# Altium schematic sheet Power.SchDoc: Power
size A; Engineer: Benjamin Beaudoin; Revision: v0.1
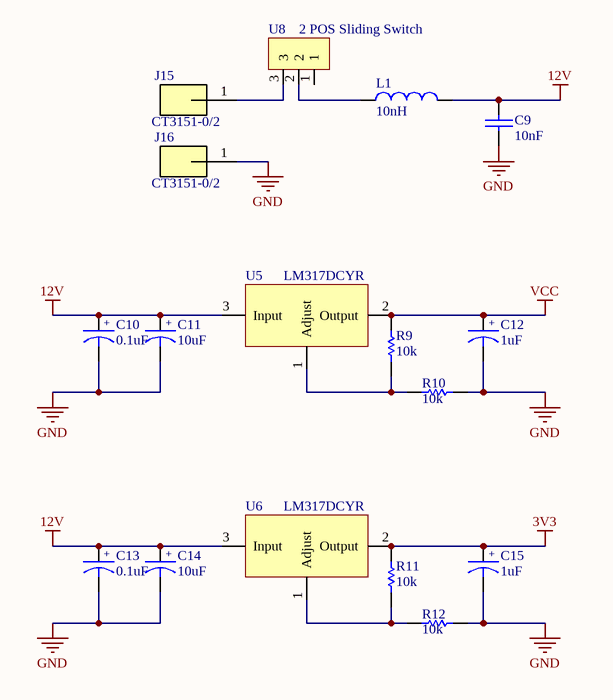
[diagram p0: Power.SchDoc]

## Parts
C9  10nF  [0603C]
C10  0.1uF  [0603C]
C11  10uF  [0603C]
C12  1uF  [0603C]
C13  0.1uF  [0603C]
C14  10uF  [0603C]
C15  1uF  [0603C]
J15  CT3151-0/2  [CT3151-0/2]
J16  CT3151-0/2  [CT3151-0/2]
L1  10nH  [0603C]
R9  10k  [0603C]
R10  10k  [0603C]
R11  10k  [0603C]
R12  10k  [0603C]
U5  LM317DCYR  [LM317]
U6  LM317DCYR  [LM317]
U8  2 POS Sliding Switch  [2 POS Sliding switch]

## Nets
3V3: C15.1 R11.2 U6.2(Output)
12V: C9.1 C10.1 C11.1 C13.1 C14.1 L1.2 U5.3(Input) U6.3(Input)
GND: C9.2 C10.2 C11.2 C12.2 C13.2 C14.2 C15.2 J16.1 R10.2 R12.2
VCC: C12.1 R9.2 U5.2(Output)
NetJ15_1: J15.1 U8.3
NetL1_1: L1.1 U8.2
NetR9_1: R9.1 R10.1 U5.1(Adjust)
NetR11_1: R11.1 R12.1 U6.1(Adjust)

Not connected (* = marked no-connect by the designer): U8 1

## Notes on the sheet
- (in symbol CPoly) +

## Library data of the parts
C9 = C: Capacitor; Power_WV_SRF: 25V; MFGPN: *; MFG: *; Value: 10nF; Tolerance: *; TempCo: *; Distributor: *; CMPN: *
C10-C15 = CPoly: Cap Poly; Power_WV_SRF: 35V; MFG: *; MFGPN: *; Tolerance: *; Temp Coef: *; Distributor Reg Num: *; Distributor: *; CMPN: *
  C10 C13: Value: 0.1uF
  C11 C14: Value: 10uF
  C12 C15: Value: 1uF
J15 J16 = CT3151-0/2: CONN BANANA JACK SOLDER BLACK; MF: Cal Test Electronics; Digi-Key_Purchase_URL: https://www.digikey.com/product-detail/en/cal-test-electronics/CT3151-0/BKCT3151-0-ND/6005441; Digi-Key_Part_Number: BKCT3151-0-ND; Package: None; SnapEDA_Link: CT3151-2; MP: CT3151-0	/2; Value: *
L1 = L: Inductor; MFG: *; MFGPN: *; Value: 10nH; Tolerance: *; Current: *; Power_WV_SRF: *; Distributor: *; CMPN: *
R9-R12 = R: Resistor; Tolerance: 5%; Value: 10k; Power_WV_SRF: *; MFG: *; MFGPN: *; Distributor: *; CMPN: *
U5 U6 = LM317